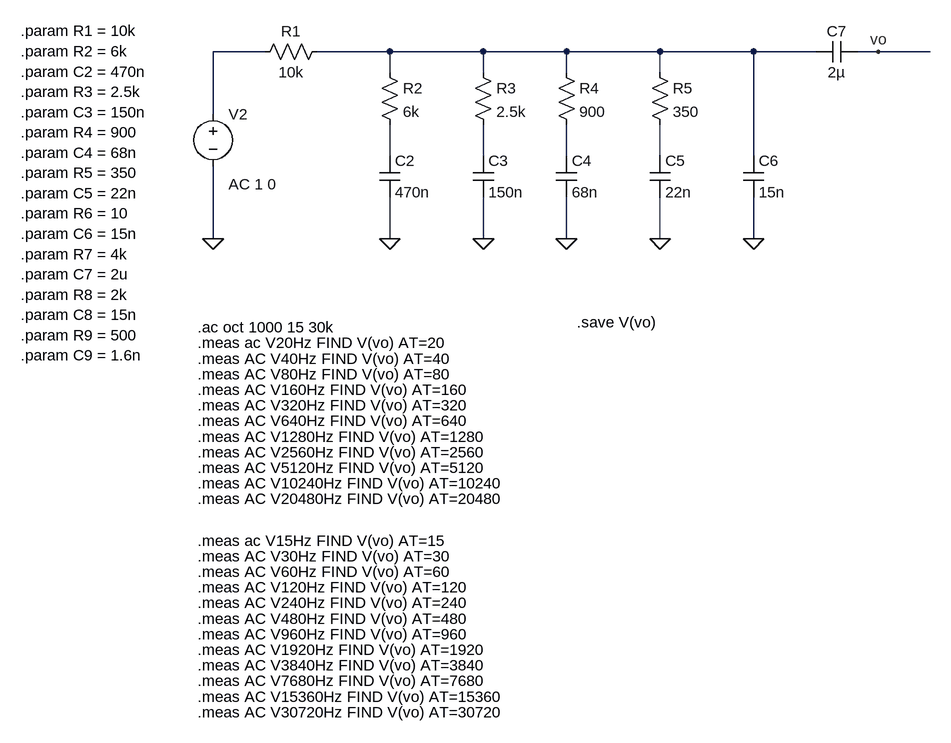
[diagram p0: schematic Project_Draft.asc]
Project_Draft.asc, the LTspice schematic file:
Version 4.1
SHEET 1 1440 856
WIRE 112 -176 32 -176
WIRE 304 -176 192 -176
WIRE 448 -176 304 -176
WIRE 576 -176 448 -176
WIRE 720 -176 576 -176
WIRE 864 -176 720 -176
WIRE 960 -176 864 -176
WIRE 1056 -176 1024 -176
WIRE 1136 -176 1056 -176
WIRE 304 -144 304 -176
WIRE 448 -144 448 -176
WIRE 576 -144 576 -176
WIRE 720 -144 720 -176
WIRE 32 -80 32 -176
WIRE 304 -16 304 -64
WIRE 448 -16 448 -64
WIRE 576 -16 576 -64
WIRE 720 -16 720 -64
WIRE 864 -16 864 -176
WIRE 32 112 32 0
WIRE 304 112 304 48
WIRE 448 112 448 48
WIRE 576 112 576 48
WIRE 720 112 720 48
WIRE 864 112 864 48
FLAG 32 112 0
FLAG 304 112 0
FLAG 1056 -176 vo
FLAG 448 112 0
FLAG 720 112 0
FLAG 576 112 0
FLAG 864 112 0
SYMBOL voltage 32 -96 R0
WINDOW 3 28 83 Left 2
WINDOW 123 24 124 Left 2
WINDOW 39 0 0 Left 0
SYMATTR Value ""
SYMATTR Value2 AC 1 0
SYMATTR InstName V2
SYMBOL res 208 -192 R90
WINDOW 0 0 56 VBottom 2
WINDOW 3 32 56 VTop 2
SYMATTR InstName R1
SYMATTR Value 10k
SYMBOL cap 288 -16 R0
SYMATTR InstName C2
SYMATTR Value 470n
SYMBOL res 288 -160 R0
SYMATTR InstName R2
SYMATTR Value 6k
SYMBOL cap 432 -16 R0
SYMATTR InstName C3
SYMATTR Value 150n
SYMBOL cap 704 -16 R0
SYMATTR InstName C5
SYMATTR Value 22n
SYMBOL res 432 -160 R0
SYMATTR InstName R3
SYMATTR Value 2.5k
SYMBOL res 704 -160 R0
SYMATTR InstName R5
SYMATTR Value 350
SYMBOL cap 560 -16 R0
SYMATTR InstName C4
SYMATTR Value 68n
SYMBOL res 560 -160 R0
SYMATTR InstName R4
SYMATTR Value 900
SYMBOL cap 848 -16 R0
SYMATTR InstName C6
SYMATTR Value 15n
SYMBOL cap 1024 -192 R90
WINDOW 0 0 32 VBottom 2
WINDOW 3 32 32 VTop 2
SYMATTR InstName C7
SYMATTR Value 2µ
TEXT 8 248 Left 2 !.ac oct 1000 15 30k
TEXT 8 272 Left 2 !.meas ac V20Hz FIND V(vo) AT=20
TEXT 8 296 Left 2 !.meas AC V40Hz FIND V(vo) AT=40
TEXT 8 320 Left 2 !.meas AC V80Hz FIND V(vo) AT=80
TEXT 8 344 Left 2 !.meas AC V160Hz FIND V(vo) AT=160
TEXT 8 368 Left 2 !.meas AC V320Hz FIND V(vo) AT=320
TEXT 8 392 Left 2 !.meas AC V640Hz FIND V(vo) AT=640
TEXT 8 416 Left 2 !.meas AC V1280Hz FIND V(vo) AT=1280
TEXT 8 440 Left 2 !.meas AC V2560Hz FIND V(vo) AT=2560
TEXT 8 464 Left 2 !.meas AC V5120Hz FIND V(vo) AT=5120
TEXT 8 488 Left 2 !.meas AC V10240Hz FIND V(vo) AT=10240
TEXT 8 512 Left 2 !.meas AC V20480Hz FIND V(vo) AT=20480
TEXT 8 576 Left 2 !.meas ac V15Hz FIND V(vo) AT=15
TEXT 8 600 Left 2 !.meas AC V30Hz FIND V(vo) AT=30
TEXT 8 624 Left 2 !.meas AC V60Hz FIND V(vo) AT=60
TEXT 8 648 Left 2 !.meas AC V120Hz FIND V(vo) AT=120
TEXT 8 672 Left 2 !.meas AC V240Hz FIND V(vo) AT=240
TEXT 8 696 Left 2 !.meas AC V480Hz FIND V(vo) AT=480
TEXT 8 720 Left 2 !.meas AC V960Hz FIND V(vo) AT=960
TEXT 8 744 Left 2 !.meas AC V1920Hz FIND V(vo) AT=1920
TEXT 8 768 Left 2 !.meas AC V3840Hz FIND V(vo) AT=3840
TEXT 8 792 Left 2 !.meas AC V7680Hz FIND V(vo) AT=7680
TEXT 8 816 Left 2 !.meas AC V15360Hz FIND V(vo) AT=15360
TEXT 8 840 Left 2 !.meas AC V30720Hz FIND V(vo) AT=30720
TEXT -264 -208 Left 2 !.param R1 = 10k\n.param R2 = 6k\n.param C2 = 470n\n.param R3 = 2.5k\n.param C3 = 150n\n.param R4 = 900\n.param C4 = 68n\n.param R5 = 350\n.param C5 = 22n\n.param R6 = 10\n.param C6 = 15n\n.param R7 = 4k\n.param C7 = 2u\n.param R8 = 2k\n.param C8 = 15n\n.param R9 = 500\n.param C9 = 1.6n
TEXT 592 240 Left 2 !.save V(vo)

The netlist it stands for:
* Project_Draft.asc
V2 N001 0 AC 1 0
R1 N002 N001 10k
C2 N003 0 470n
R2 N002 N003 6k
C3 N004 0 150n
C5 N006 0 22n
R3 N002 N004 2.5k
R5 N002 N006 350
C4 N005 0 68n
R4 N002 N005 900
C6 N002 0 15n
C7 vo N002 2µ
.ac oct 1000 15 30k
.meas ac V20Hz FIND V(vo) AT=20
.meas AC V40Hz FIND V(vo) AT=40
.meas AC V80Hz FIND V(vo) AT=80
.meas AC V160Hz FIND V(vo) AT=160
.meas AC V320Hz FIND V(vo) AT=320
.meas AC V640Hz FIND V(vo) AT=640
.meas AC V1280Hz FIND V(vo) AT=1280
.meas AC V2560Hz FIND V(vo) AT=2560
.meas AC V5120Hz FIND V(vo) AT=5120
.meas AC V10240Hz FIND V(vo) AT=10240
.meas AC V20480Hz FIND V(vo) AT=20480
.meas ac V15Hz FIND V(vo) AT=15
.meas AC V30Hz FIND V(vo) AT=30
.meas AC V60Hz FIND V(vo) AT=60
.meas AC V120Hz FIND V(vo) AT=120
.meas AC V240Hz FIND V(vo) AT=240
.meas AC V480Hz FIND V(vo) AT=480
.meas AC V960Hz FIND V(vo) AT=960
.meas AC V1920Hz FIND V(vo) AT=1920
.meas AC V3840Hz FIND V(vo) AT=3840
.meas AC V7680Hz FIND V(vo) AT=7680
.meas AC V15360Hz FIND V(vo) AT=15360
.meas AC V30720Hz FIND V(vo) AT=30720
.param R1 = 10k
.param R2 = 6k
.param C2 = 470n
.param R3 = 2.5k
.param C3 = 150n
.param R4 = 900
.param C4 = 68n
.param R5 = 350
.param C5 = 22n
.param R6 = 10
.param C6 = 15n
.param R7 = 4k
.param C7 = 2u
.param R8 = 2k
.param C8 = 15n
.param R9 = 500
.param C9 = 1.6n
.save V(vo)
.backanno
.end